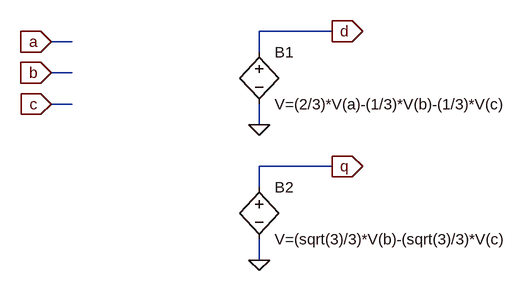
[diagram p0: schematic abc to ab.asc]
abc to ab.asc, the LTspice schematic file:
Version 4
SHEET 1 880 680
WIRE 480 112 368 112
WIRE 80 128 48 128
WIRE 368 144 368 112
WIRE 80 176 48 176
WIRE 80 224 48 224
WIRE 368 256 368 224
WIRE 480 320 368 320
WIRE 368 352 368 320
WIRE 368 464 368 432
FLAG 48 128 a
IOPIN 48 128 In
FLAG 48 176 b
IOPIN 48 176 In
FLAG 48 224 c
IOPIN 48 224 In
FLAG 368 256 0
FLAG 368 464 0
FLAG 480 112 d
IOPIN 480 112 Out
FLAG 480 320 q
IOPIN 480 320 Out
SYMBOL bv 368 128 R0
SYMATTR InstName B1
SYMATTR Value V=(2/3)*V(a)-(1/3)*V(b)-(1/3)*V(c)
SYMBOL bv 368 336 R0
SYMATTR InstName B2
SYMATTR Value V=(sqrt(3)/3)*V(b)-(sqrt(3)/3)*V(c)

The netlist it stands for:
* abc to ab.asc
B1 d 0 V=(2/3)*V(a)-(1/3)*V(b)-(1/3)*V(c)
B2 q 0 V=(sqrt(3)/3)*V(b)-(sqrt(3)/3)*V(c)
.backanno
.end